# EAGLE design shoes (EAGLE 7.3.0)
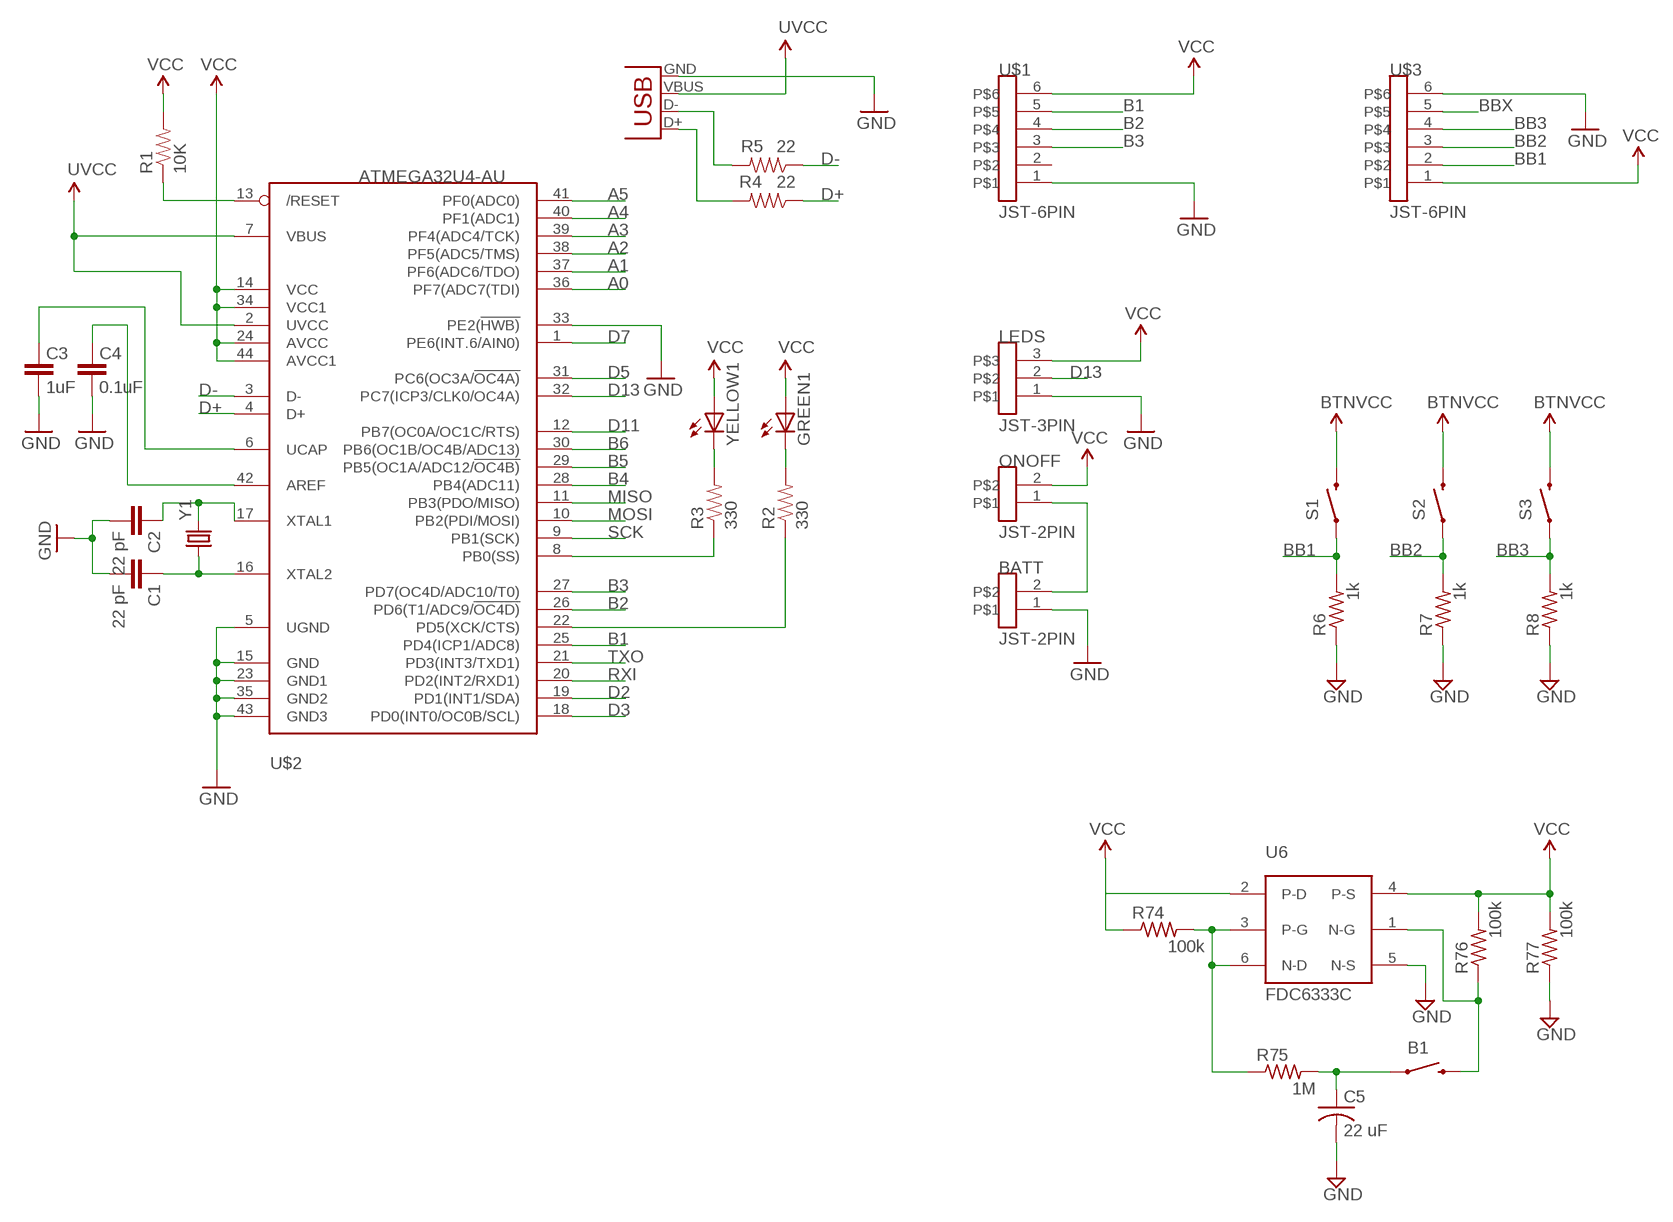
[diagram p0: schematic, sheet 1]

## Parts
B1  SWITCH-MOMENTARY-2GULLWING  [BUTTON-GULLWING]
BATT  JST-2PIN  [JST-PH-2]
C1  22 pF  CAP0805  [0805]
C2  22 pF  CAP0805  [0805]
C3  1uF  CAP0805  [0805]
C4  0.1uF  CAP0805  [0805]
C5  22 uF  CAP1206_P  [1206_P]
GREEN1  LED  [0805_P]
LEDS  JST-3PIN  [JST-PH-3]
ONOFF  JST-2PIN  [JST-PH-2]
R1  10K  RESISTOR0805-RES  [0805]
R2  330  RESISTOR0805-RES  [0805]
R3  330  RESISTOR0805-RES  [0805]
R4  22  RESISTOR0805-RES  [0805]
R5  22  RESISTOR0805-RES  [0805]
R6  1k  R0805  [0805]
R7  1k  R0805  [0805]
R8  1k  R0805  [0805]
R74  100k  R0603  [0603]
R75  1M  R0603  [0603]
R76  100k  R0603  [0603]
R77  100k  R0603  [0603]
S1  SWITCH-MOMENTARY-2GULLWING  [BUTTON-GULLWING]
S2  SWITCH-MOMENTARY-2GULLWING  [BUTTON-GULLWING]
S3  SWITCH-MOMENTARY-2GULLWING  [BUTTON-GULLWING]
U6  FDC6333C  [SOT-23]
U$1  JST-6PIN  [JST-PH-6]
U$2  ATMEGA32U4-AU  [TQFP44]
U$3  JST-6PIN  [JST-PH-6]
X2  USB-MICROB  [USB-MICROB]
Y1  CRYSTALHC49US  [HC49US]
YELLOW1  LED  [0805_P]

## Nets
3.3V: R76.2 R77.2 U6.4(P-S) ; supply symbol labelled VCC
5V: GREEN1.NEG(A) LEDS.3 ONOFF.2 R1.2 U$1.6 U$2.14(VCC) U$2.24(AVCC) U$2.34(VCC1) U$2.44(AVCC1) YELLOW1.NEG(A) ; supply symbol labelled VCC
A0: U$2.36(PF7(ADC7(TDI))
A1: U$2.37(PF6(ADC6/TDO))
A2: U$2.38(PF5(ADC5/TMS))
A3: U$2.39(PF4(ADC4/TCK))
A4: U$2.40(PF1(ADC1))
A5: U$2.41(PF0(ADC0))
B1: U$1.5 U$2.25(PD4(ICP1/ADC8))
B2: U$1.4 U$2.26(PD6(T1/ADC9/!OC4D))
B3: U$1.3 U$2.27(PD7(OC4D/ADC10/T0))
B4: U$2.28(PB4(ADC11))
B5: U$2.29(PB5(OC1A/ADC12/!OC4B))
B6: U$2.30(PB6(OC1B/OC4B/ADC13))
BB1: R6.POS S1.A1 U$3.2
BB2: R7.POS S2.A1 U$3.3
BB3: R8.POS S3.A1 U$3.4
BBX: U$3.5
BTNGND [vcc]: R6.NEG R7.NEG R8.NEG U$3.6 ; supply symbol labelled GND
BTNVCC: S1.B1 S2.B1 S3.B1 U$3.1 ; supply symbol labelled VCC
D2: U$2.19(PD1(INT1/SDA))
D3: U$2.18(PD0(INT0/OC0B/SCL))
D5: U$2.31(PC6(OC3A/!OC4A))
D7: U$2.1(PE6(INT.6/AIN0))
D11: U$2.12(PB7(OC0A/OC1C/RTS))
D13: LEDS.2 U$2.32(PC7(ICP3/CLK0/OC4A))
D14: R3.1 U$2.8(PB0(SS))
D+: R4.1 U$2.4(D+)
D-: R5.1 U$2.3(D-)
GND: BATT.1 C1.POS C2.POS C3.1 C4.1 C5.2(NEG) LEDS.1 R77.1 U6.5(N-S) U$1.1 U$2.5(UGND) U$2.15(GND) U$2.23(GND1) U$2.33(PE2(!HWB)) U$2.35(GND2) U$2.43(GND3) X2.GND
MISO: U$2.11(PB3(PDO/MISO))
MOSI: U$2.10(PB2(PDI/MOSI))
N$1: C2.NEG U$2.17(XTAL1) Y1.2
N$3: R4.2 X2.D+
N$4: R5.2 X2.D-
N$9: C1.NEG U$2.16(XTAL2) Y1.1
N$11: C4.2 U$2.42(AREF)
N$12: C3.2 U$2.6(UCAP)
N$14: R3.2 YELLOW1.POS(C)
N$16: GREEN1.POS(C) R2.2
N$39: B1.B1 R76.1 U6.1(N-G)
N$40: R74.2 R75.1 U6.3(P-G) U6.6(N-D)
N$42: B1.A1 C5.1(POS) R75.2
RESET1: R1.1 U$2.13(/RESET)
RXI: U$2.20(PD2(INT2/RXD1))
SCK: U$2.9(PB1(SCK))
TXLED: R2.1 U$2.22(PD5(XCK/CTS))
TXO: U$2.21(PD3(INT3/TXD1))
UVCC: U$2.2(UVCC) U$2.7(VBUS) X2.VBUS
VIN: BATT.2 ONOFF.1 R74.1 U6.2(P-D) ; supply symbol labelled VCC
Unconnected: U$1.2

## Library data of the parts
B1 S1-S3 = LIT:SWITCH-MOMENTARY-2: Various NO switches- pushbuttons, reed, etc
BATT ONOFF = chromatico:JST-2PIN
C1 C2 = LIT:CAP0805
C3 C4 = SparkFun:CAP: Capacitor Standard 0603 ceramic capacitor, and 0.1" leaded capacitor.
C5 = LIT:CAP1206_P
GREEN1 YELLOW1 = chromatico:LED: LEDs Standard schematic elements and footprints for 5mm, 3mm, 1206, and 0603 sized LEDs. 5mm - Spark Fun Electronics SKU : COM-00529 (and others)
LEDS = chromatico:JST-3PIN
R1-R5 = SparkFun:RESISTOR: Resistor Basic schematic elements and footprints for 0603, 1206, and PTH resistors.
R6-R8 = chromatico:R0805
R74-R77 = LIT-2:R0603
U6 = LIT-2:FDC6333C
U$1 U$3 = chromatico:JST-6PIN
U$2 = chromatico:ATMEGA32U4: http://www.ladyada.net/library/eagle
X2 = SparkFun-Connectors:USB: USB Connectors USB-B-PTH is fully proven SKU : PRT-00139 USB-miniB is fully proven SKU : PRT-00587 USB-A-PCB is untested. USB-A-H is throughly reviewed, but untested. Spark Fun Electronics SKU : PRT-00437 USB-B-SMT is throughly reviewed, but untested. Needs silkscreen touching up. USB-A-S has not been used/tested USB-MB-H has not been used/tested
Y1 = chromatico:CRYSTAL: Crystals Various standard crystals. Proven footprints. Spark Fun Electronics SKU : COM-00534

## Board
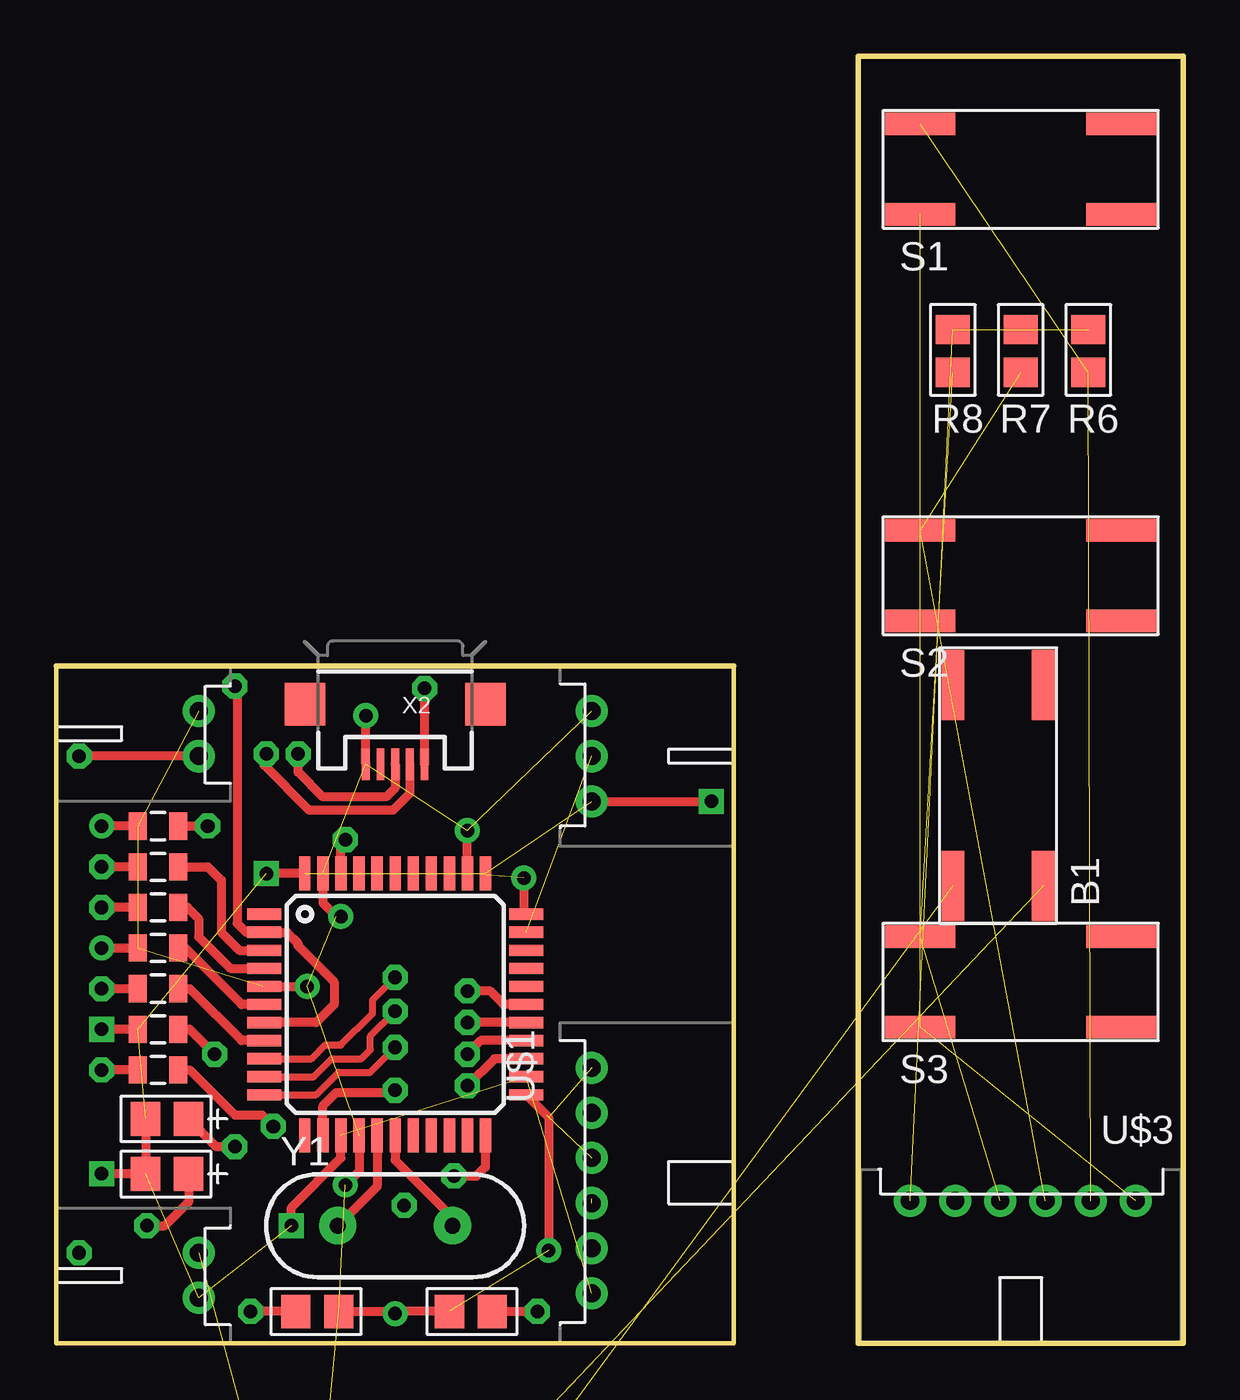
[diagram p1: board, top side]
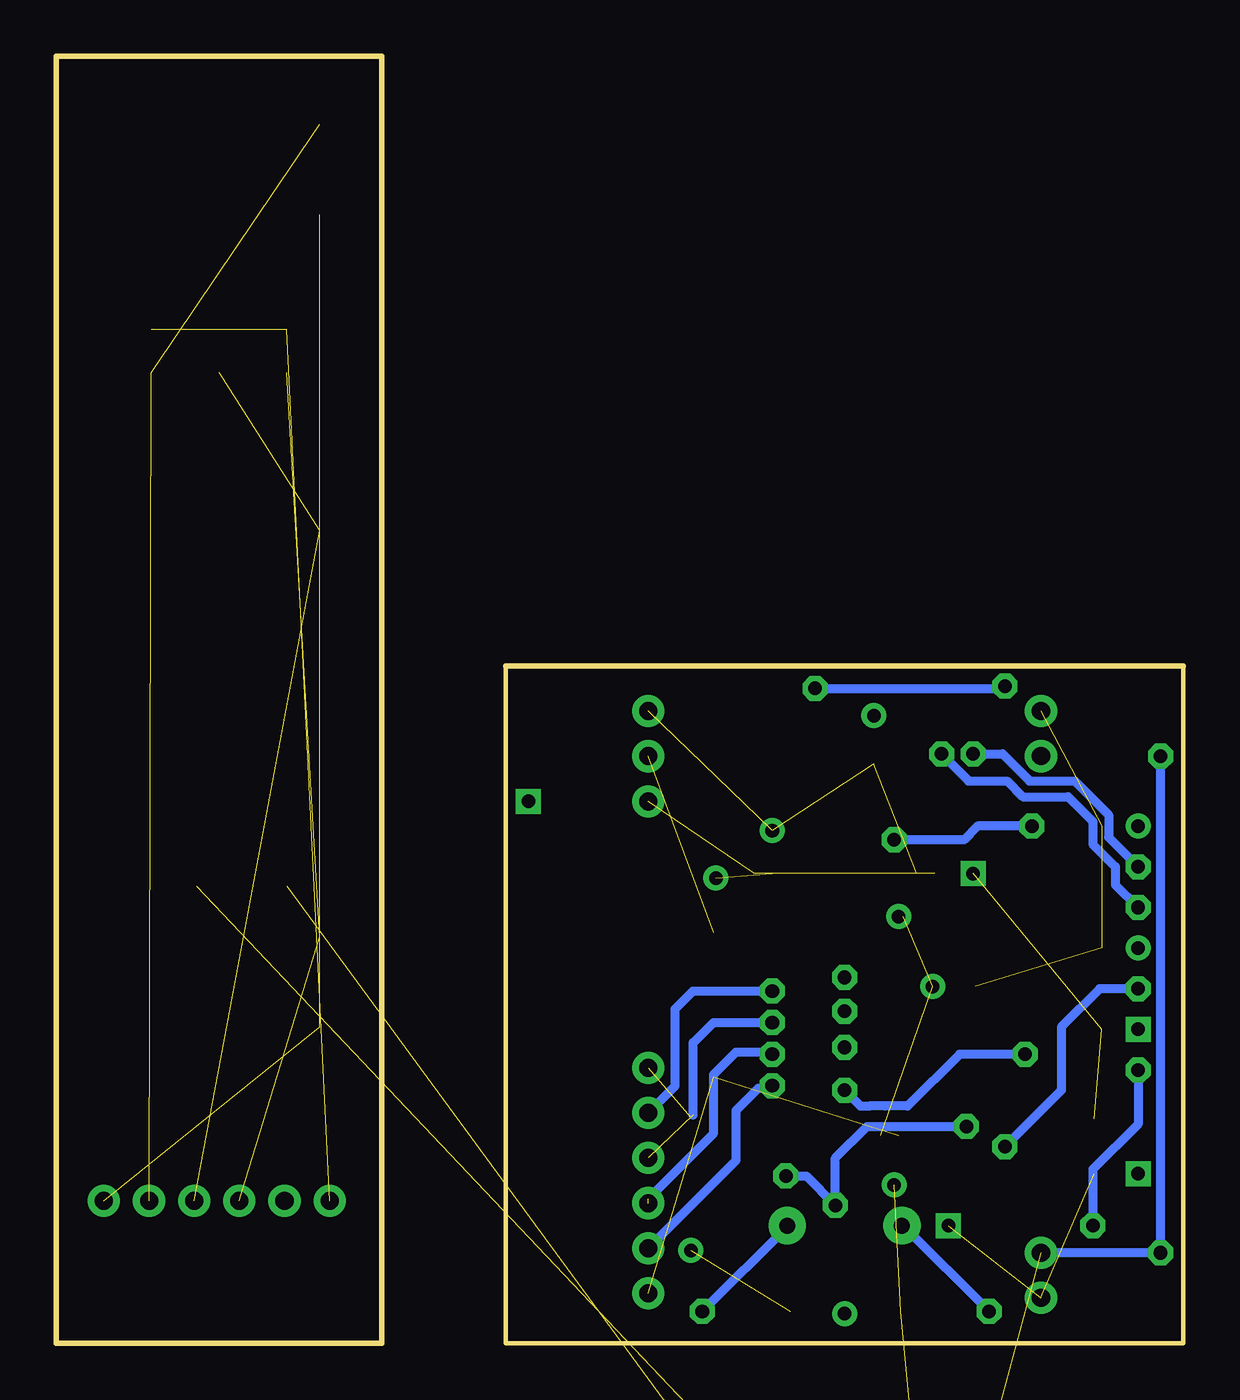
[diagram p2: board, bottom side, seen from below]

Size 49.9 x 57 mm. Coordinates in mm from the lower left corner, seen from the top.
Outline: 0,30.02 0,30
Outline: 0,30 0,0 30,0 30,30 0,30
Outline: 49.9,0 35.5,0 35.5,57 49.9,57 49.9,0
Copper layers (1*16): Top 0.035mm / dielectric 1.5mm / Bottom 0.035mm
Design rules "default": minimum track width 8mil, minimum drill 15mil, track to track 7mil, track to pad 7mil, pad to pad 7mil, via to via 7mil, smd to smd 7mil, copper to edge 7mil, drill to drill 7mil, minimum pad ring 12mil, minimum via ring 10mil, stop-mask expansion 4mil, vias tented up to drill 20mil, thermal gap 10mil

### Footprints (pad centres in the part's own frame; a part is rotated, then mirrored left to right if it is on the bottom)
BUTTON-GULLWING = smd 1 x 3.1: A1 -2,-4.45; A2 -2,4.45; B1 2,-4.45; B2 2,4.45
JST-PH-2 = drill 0.8 pad 1.422: 1 2,0; 2 0,0
0805 = smd 1.3 x 1.5: NEG 1.9,0; POS 0,0
0805' = smd 0.8 x 1.2: 1 -0.9,0; 2 0.9,0
1206_P = smd 0.889 x 1.778: 1 0.006,-0.07; 2 3.054,-0.07
0805_P = smd 1.3 x 1.5: NEG 1.9,0; POS 0,0
JST-PH-3 = drill 0.8 pad 1.422: 1 0,0; 2 2,0; 3 4,0
0603 = smd 1 x 1.1: 1 0,0; 2 1.7,0
SOT-23 = smd 1.1 x 0.6: 1 0.55,2.2; 2 0.55,1.25; 3 0.55,0.3; 4 3.35,0.3; 5 3.35,1.25; 6 3.35,2.2
JST-PH-6 = drill 0.8 pad 1.422: 1 0,0; 2 2,0; 3 4,0; 4 6,0; 5 8,0; 6 10,0
TQFP44 = smd 1.5 x 0.5: 1 -5.8,4; 2 -5.8,3.2; 3 -5.8,2.4; 4 -5.8,1.6; 5 -5.8,0.8; 6 -5.8,0; 7 -5.8,-0.8; 8 -5.8,-1.6; 9 -5.8,-2.4; 10 -5.8,-3.2; 11 -5.8,-4; 23 5.8,-4; 24 5.8,-3.2; 25 5.8,-2.4; 26 5.8,-1.6; 27 5.8,-0.8; 28 5.8,0; 29 5.8,0.8; 30 5.8,1.6; 31 5.8,2.4; 32 5.8,3.2; 33 5.8,4 | smd 0.5 x 1.5: 12 -4,-5.8; 13 -3.2,-5.8; 14 -2.4,-5.8; 15 -1.6,-5.8; 16 -0.8,-5.8; 17 0,-5.8; 18 0.8,-5.8; 19 1.6,-5.8; 20 2.4,-5.8; 21 3.2,-5.8; 22 4,-5.8; 34 4,5.8; 35 3.2,5.8; 36 2.4,5.8; 37 1.6,5.8; 38 0.8,5.8; 39 0,5.8; 40 -0.8,5.8; 41 -1.6,5.8; 42 -2.4,5.8; 43 -3.2,5.8; 44 -4,5.8
USB-MICROB = smd 0.35 x 1.4: D+ 0,2.65; D- -0.65,2.65; GND 1.3,2.65; ID 0.65,2.65; VBUS -1.3,2.65 | smd 1.8 x 1.9: MT1 -4,0; MT2 4,0
HC49US = drill 0.7 pad 1.651: 1 -2.54,0; 2 2.54,0

### Placement (x,y rotation side)
B1  41.7,24.7 0 top
BATT  6.3,26 90 top
C1  12.5,1.4 180 top
C2  17.4,1.4 0 top
C3  1uF  [0805']  4.5,17.5 0 top
C4  0.1uF  [0805']  4.5,22.9 0 top
C5  7,-24.3 0 top  (outside the outline)
GREEN1  5.85,7.49 180 top
LEDS  23.7,28 270 top
ONOFF  6.3,2 90 top
R1  10K  [0805']  4.5,13.9 180 top
R2  330  [0805']  4.5,12.1 180 top
R3  330  [0805']  4.5,15.7 180 top
R4  22  [0805']  4.5,19.3 180 top
R5  22  [0805']  4.5,21.1 180 top
R6  45.7,43 90 top
R7  42.7,43 90 top
R8  39.7,43 90 top
R74  13.9,-24.2 0 top  (outside the outline)
R75  2.9,-30 0 top  (outside the outline)
R76  8.4,-30 0 top  (outside the outline)
R77  13.9,-30 0 top  (outside the outline)
S1  42.7,52 270 top
S2  42.7,34 270 top
S3  42.7,16 270 top
U6  0.9,-26.6 0 top  (outside the outline)
U$1  23.7,12.2 270 top
U$2  15,15 0 top
U$3  47.8,6.3 180 top
X2  15,28.3 180 top
Y1  15,5.2 0 top
YELLOW1  5.85,9.93 180 top

### Tracks (layer width: path | path; a pad name or v marks a point on that pad's centre or on a via)
3.3V  (2 unrouted)
5V  (via drill 0.6)  (8 unrouted)
  Top 0.406: LEDS.3 v29,24 | YELLOW1.NEG GREEN1.NEG v2,7.49 v2,7.5 | U$2.44 v9.3,20.8 | R1.2 v2,13.9 | v10.4,5.2 10.4,6 12.6,8.2 U$2.14
B1  (via drill 0.6)
  Top 0.406: U$2.25 19.4,12.6 v18.2,11.4
  Bottom 0.406: U$1.5 19.8,8.1 19.8,10.3 18.8,11.3 18.3,11.3 v18.2,11.4
B2  (via drill 0.6)  (1 unrouted)
  Top 0.406: U$2.26 18.8,13.4 v18.2,12.8
  Bottom 0.406: 23.7,6.4 20.8,9.3 20.8,11.9 19.8,12.9 18.3,12.9 v18.2,12.8
B3  (via drill 0.6)  (1 unrouted)
  Top 0.406: U$2.27 v18.2,14.2
  Bottom 0.406: 21.7,10.1 21.7,13.3 U$2.27 v18.2,14.2
B4  (via drill 0.6)
  Top 0.406: U$2.28 19.8,15 19.2,15.6 v18.2,15.6
  Bottom 0.406: 23.7,10.2 22.5,11.4 22.5,14.8 21.7,15.6 v18.2,15.6
BB1  (2 unrouted)
BB2  (2 unrouted)
BB3  (2 unrouted)
BTNGND  (3 unrouted)
BTNVCC  (3 unrouted)
D13  (1 unrouted)
D14
  Top 0.406: R3.1 5.9,15.7 8.2,13.4 U$2.8
D+
  Top 0.406: R4.1 5.8,19.3 6.3,18.8 6.3,18 7.7,16.6 U$2.4
D-
  Top 0.406: R5.1 6.7,21.1 7.3,20.5 7.3,18.2 8.1,17.4 U$2.3
GND  (via drill 0.6)  (15 unrouted)
  Top 0.406: C4.1 v2,22.9 | v2,17.5 C3.1 | U$2.15 13.4,7.6 v12.8,7 | U$2.35 v18.2,22.7 | v20.7,20.6 20.7,19.1 U$2.33 | C1.POS 14.9,1.4 v15,1.3 15.1,1.4 C2.POS | U$2.23 21.8,10 v21.8,4.1 | U$2.43 11.8,19.5 12.4,18.9 v12.6,18.9 | U$2.5 v11.1,15.8 | X2.GND v13.7,27.8
MISO  (via drill 0.6)
  Top 0.305: U$2.11 11.5,11 12.5,12 13.9,12 v15,13.1
MOSI  (via drill 0.6)
  Top 0.305: U$2.10 11.4,11.8 12.2,12.6 13.5,12.6 13.9,13 13.9,13.6 v15,14.7
N$1  (via drill 0.6)
  Top 0.406: U$2.17 15,8.1 17.4,5.7 17.4,5.34 Y1.2 | C2.NEG v21.3,1.4
  Bottom 0.406: Y1.2 17.54,5.16 v21.3,1.4
N$3  (via drill 0.6)
  Top 0.406: R4.2 v2,19.3 | 15,24.9 X2.D+ 15,24.6 14.6,24.2 11.8,24.2 10.7,25.3 v10.7,26.1
  Bottom 0.406: v10.7,26.1 9.5,24.9 7.8,24.9 7.1,24.2 5.1,24.2 4,23.1 4,22.1 3,21.1 3,20.3 v2,19.3
N$4  (via drill 0.6)
  Top 0.406: R5.2 v2,21.1 | 15.65,24.65 X2.D- 15.65,24.35 14.9,23.6 11.2,23.6 9.2,25.6 9.2,26 v9.3,26.1
  Bottom 0.406: v9.3,26.1 8,26.1 6.8,24.9 4.8,24.9 3.3,23.4 3.3,22.4 v2,21.1
N$9  (via drill 0.6)
  Top 0.406: U$2.16 14.2,6.94 Y1.1 | C1.NEG v8.6,1.4
  Bottom 0.406: Y1.1 12.4,5.2 v8.6,1.4
N$11  (via drill 0.6)
  Top 0.406: U$2.42 12.6,22.1 v12.8,22.3 | C4.2 v6.7,22.9
  Bottom 0.406: v6.7,22.9 9.1,22.9 9.7,22.3 v12.8,22.3
N$12
  Top 0.406: C3.2 5.7,17.5 8.2,15 U$2.6
N$14  (via drill 0.6)
  Top 0.406: R3.2 v2,15.7 | v7.9,8.7 7.08,8.7 YELLOW1.POS
  Bottom 0.406: v2,15.7 3.7,15.7 5.4,14 5.4,11.2 v7.9,8.7
N$16  (via drill 0.6)
  Top 0.406: R2.2 v2,12.1 | GREEN1.POS 5.85,6.25 4.8,5.2 v4,5.2
  Bottom 0.406: v2,12.1 2,9.7 4,7.7 v4,5.2
N$39  (2 unrouted)
N$40  (3 unrouted)
N$42  (2 unrouted)
RESET1  (via drill 0.6)
  Top 0.406: R1.1 5.9,13.9 v7,12.8 | U$2.13 11.8,10.5 12.4,11.1 14.9,11.1 v15,11.2
  Bottom 0.406: v7,12.8 9.9,12.8 12.2,10.5 13.2,10.5 13.9,10.5 14.3,10.5 v15,11.2
SCK  (via drill 0.6)
  Top 0.305: U$2.9 11.3,12.6 11.9,13.2 12.6,13.2 14,14.6 14,15.2 v15,16.2
TXLED  (via drill 0.6)
  Top 0.406: R2.1 5.9,12.1 7.9,10.1 9.1,10.1 v9.6,9.6 | U$2.22 19,7.8 18.6,7.4 v17.6,7.4
  Bottom 0.406: v9.6,9.6 14,9.6 15.4,8.2 v15.4,6.1 16.7,7.4 v17.6,7.4
UVCC  (via drill 0.6)
  Top 0.406: U$2.7 11.5,14.2 12.3,15 12.3,16 10.7,17.6 10.7,17.7 10.2,18.2 U$2.2 8.4,18.2 8,18.6 8,29 v7.9,29.1 | X2.VBUS v16.3,29
  Bottom 0.406: v16.3,29 8,29 v7.9,29.1
VIN  (via drill 0.6)  (2 unrouted)
  Top 0.406: BATT.2 v1,26
  Bottom 0.406: v1,26 v1,4 ONOFF.1

### Text on the board
tValues: Valid combinations: | 3.3V Reg / 8MHz | 5V Reg / 16MHz | Mark back accordingly